# Altium schematic sheet top.SchDoc
size 420 x 297 mm; SheetNumber: 1; SheetTotal: 1
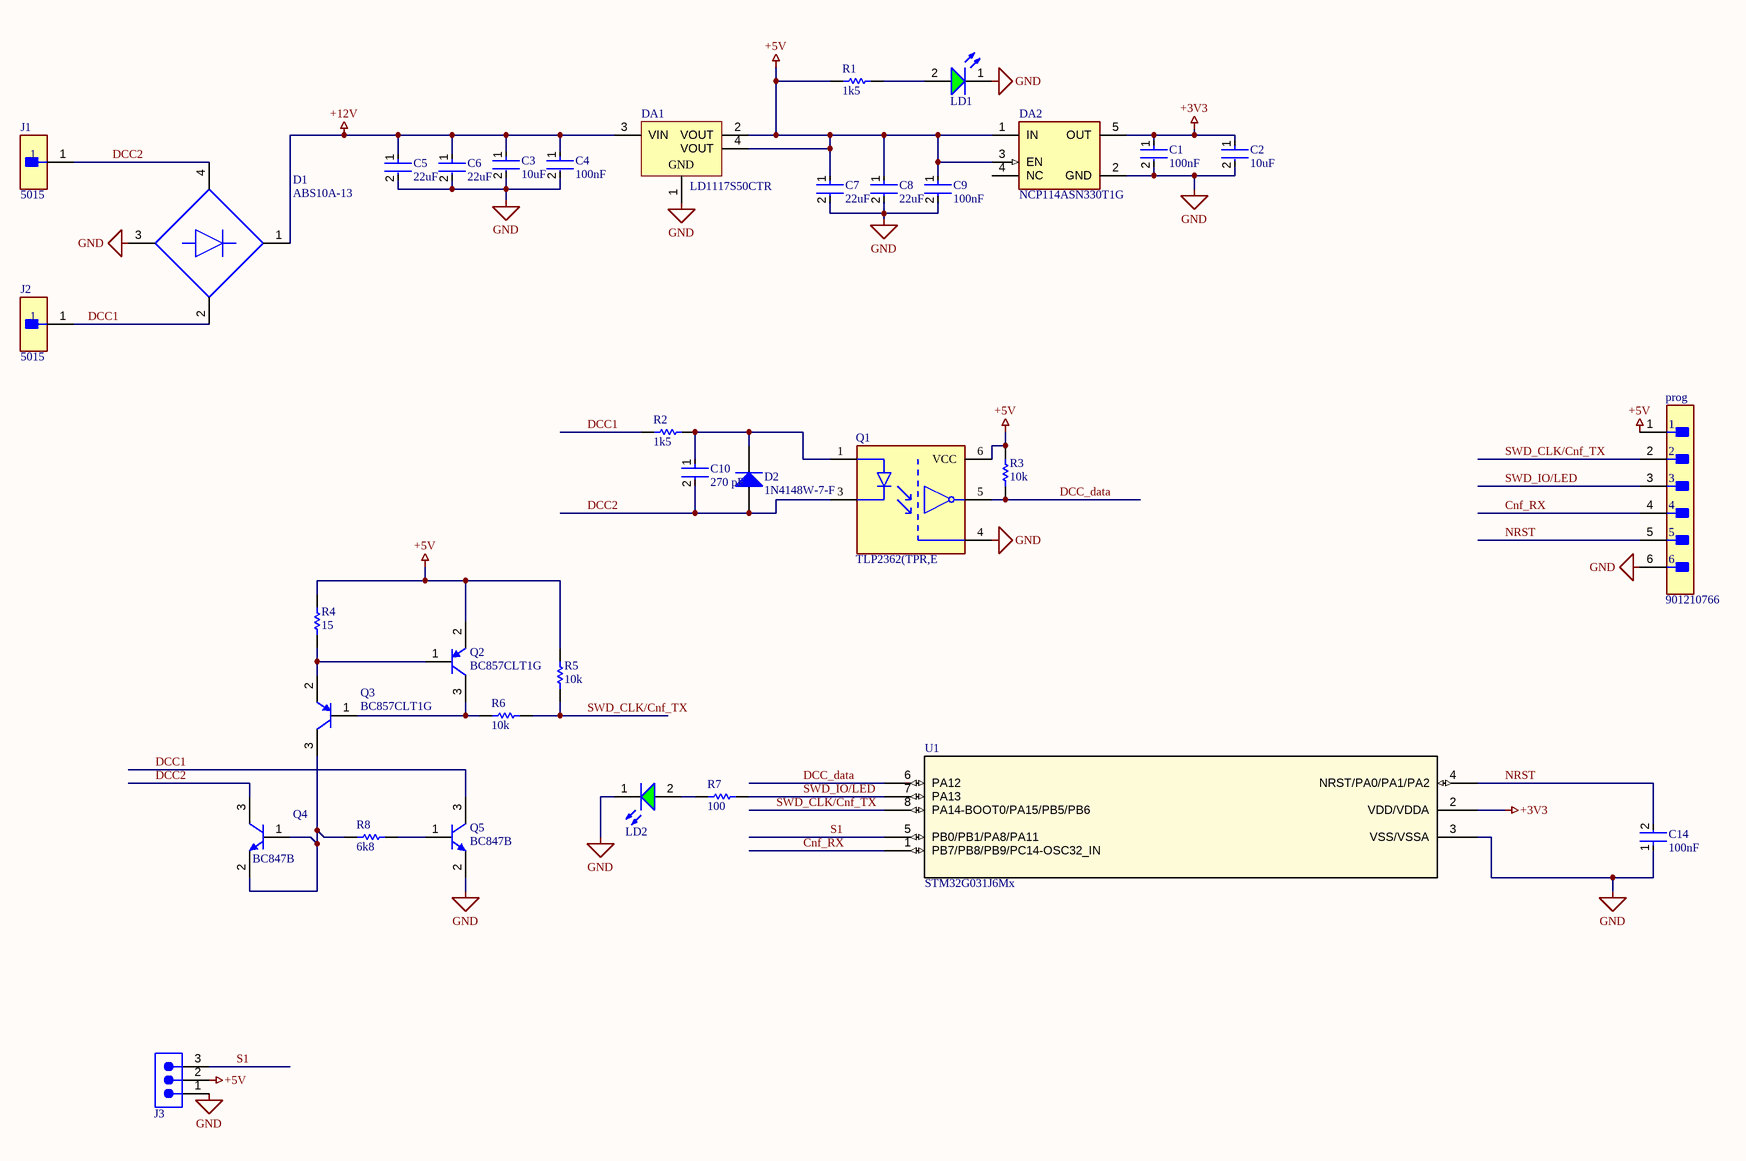
[diagram p0: top.SchDoc]

## Parts
C1  Capacitance: 100nF  [FP-CGA3E-0_3-0_1-MFG]  (hidden comment: CGA3E2X7R1H104K080AA)
C2  Capacitance: 10uF  [FP-GRM188-0_1-e0_2_0_55-MFG]  (hidden comment: GRM188R60J106ME47D)
C3  Capacitance: 10uF  [FP-GRM188-0_1-e0_2_0_55-MFG]  (hidden comment: GRM188R60J106ME47D)
C4  Capacitance: 100nF  [FP-CGA3E-0_3-0_1-MFG]  (hidden comment: CGA3E2X7R1H104K080AA)
C5  Capacitance: 22uF  [FP-GRM188-0_2-MFG]  (hidden comment: GRM188R61A226ME15D)
C6  Capacitance: 22uF  [FP-GRM188-0_2-MFG]  (hidden comment: GRM188R61A226ME15D)
C7  Capacitance: 22uF  [FP-GRM188-0_2-MFG]  (hidden comment: GRM188R61A226ME15D)
C8  Capacitance: 22uF  [FP-GRM188-0_2-MFG]  (hidden comment: GRM188R61A226ME15D)
C9  Capacitance: 100nF  [FP-CGA3E-0_3-0_1-MFG]  (hidden comment: CGA3E2X7R1H104K080AA)
C10  value 270 pF  [FP-C0603C-CF-IPC_C]  (hidden comment: C0603C271J5GACTU)
C14  Capacitance: 100nF  [FP-CGA3E-0_3-0_1-MFG]  (hidden comment: CGA3E2X7R1H104K080AA)
D1  ABS10A-13  [FP-SOPA-4-MFG]
D2  1N4148W-7-F  [DIOD-SOD123-2_V]
DA1  LD1117S50CTR  [SOT-223_N]
DA2  NCP114ASN330T1G  [FP-483-MFG]
J1  5015  [FP-5015-MFG]
J2  5015  [FP-5015-MFG]
J3  61300311021  [61300311021]  (value not drawn)
LD1  150060VS75000  [WL-SMCW_0603_150060xx75000]  (value not drawn)
LD2  150060VS75000  [WL-SMCW_0603_150060xx75000]  (value not drawn)
prog  901210766  [FP-901210766-MFG]
Q1  TLP2362(TPR,E  [FP-11-4L1S-MFG]
Q2  BC857CLT1G  [ONSC-SOT-23-3-318-08_V]
Q3  BC857CLT1G  [ONSC-SOT-23-3-318-08_V]
Q4  BC847B  [INF-SOT23_M]
Q5  BC847B  [INF-SOT23_M]
R1  value 1k5  [RESC1608X55X25ML10T15]  (hidden comment: RC0603FR-071K5L)
R2  value 1k5  [RESC1608X55X25ML10T15]  (hidden comment: RC0603FR-071K5L)
R3  value 10k  [RESC1609X55X30NL15T15]  (hidden comment: ERJ3EKF1002V)
R4  value 15  [RESC1608X55X30NL15T15]  (hidden comment: ERJ-3EKF1502V)
R5  value 10k  [RESC1609X55X30NL15T15]  (hidden comment: ERJ3EKF1002V)
R6  value 10k  [RESC1609X55X30NL15T15]  (hidden comment: ERJ3EKF1002V)
R7  value 100  [RESC1608X55X30NL15T15]  (hidden comment: ERJ-3EKF1003V)
R8  value 6k8  [RESC1608X55X25NL10T15]  (hidden comment: RC0603FR-076K8L)
U1  STM32G031J6Mx  [SO-8]

## Nets
+3V3: C1.1 C2.1 DA2.5(OUT) U1.2(VDD/VDDA)
+5V: C7.1 C8.1 C9.1 DA1.2(VOUT) DA1.4(VOUT) DA2.1(IN) DA2.3(EN) J3.2 prog.1 Q1.6(VCC) Q2.2(E) R1.1 R3.1 R4.2 R5.1
+12V: C3.1 C4.1 C5.1 C6.1 D1.1(+) DA1.3(VIN)
GND: C1.2 C2.2 C3.2 C4.2 C5.2 C6.2 C7.2 C8.2 C9.2 C14.1 D1.3(-) DA1.1(GND) DA2.2(GND) J3.1 LD1.1(K) LD2.1(K) prog.6 Q1.4(GND) Q5.2(E) U1.3(VSS/VSSA)
Cnf_RX: prog.4 U1.1(PB7/PB8/PB9/PC14-OSC32_IN)
DCC1: D1.2(1_~) J2.1 Q5.3(C) R2.1
DCC2: C10.2 D1.4(2_~) D2.1(A) J1.1 Q1.3(C) Q4.3(C)
DCC_data: Q1.5(Vo(output)) R3.2 U1.6(PA12)
NRST: C14.2 prog.5 U1.4(NRST/PA0/PA1/PA2)
S1: J3.3 U1.5(PB0/PB1/PA8/PA11)
SWD_CLK/Cnf_TX: prog.2 R5.2 R6.1 U1.8(PA14-BOOT0/PA15/PB5/PB6)
SWD_IO/LED: prog.3 R7.1 U1.7(PA13)
NetC10_1: C10.1 D2.2(K) Q1.1(A) R2.2
NetLD1_2: LD1.2(A) R1.2
NetLD2_2: LD2.2(A) R7.2
NetQ2_1: Q2.1(B) Q3.2(E) R4.1
NetQ2_3: Q2.3(C) Q3.1(B) R6.2
NetQ3_3: Q3.3(C) Q4.1(B) Q4.2(E) R8.1
NetQ5_1: Q5.1(B) R8.2

Not connected (* = marked no-connect by the designer): DA2 4(NC)

## Notes on the sheet
- THIS DOCUMENT AND THE DATA DISCLOSED HEREIN OR
- HEREWITH IS THE PROPERTY OF ALTIUM LIMITED AND MAY
- DWG NO:
- REVISION
- REV:
- DESCRIPTION
- DATE
- APPROVED
- BE FREELY DISTRIBUTED IN WHOLE. NO RIGHTS ARE
- RESERVED OR EXPRESS OR IMPLIED WARANTEE GIVEN.
- ENG:
- APPROVALS
- PROJECT
- DSN:
- CHK:
- REFERENCE DOCUMENTS
- PROJECT REVISION:
- TITLE
- DOCUMENT REVISION:
- DESIGN ITEM:
- BOM:
- FAB DWG:
- PCB DWG:
- ASSY DWG:
- SCALE:
- A3
- SIZE
- CAGE CODE
- FILE NAME
- DWG NO.
- SHEET
- OF
- REV

## Library data of the parts
C1 C4 C9 C14 = CMP-2000-07546-2: Cap Ceramic 100nF 50V X7R 10% Pad SMD 0603 +125°C Automotive T/R; Weight: 7.1E-05oz; Composition: Ceramic; Max Operating Temperature: 125°C; Termination: SMD/SMT; Dielectric: X7R; Length: 1.6mm; Package Quantity: 1; REACH SVHC: No SVHC; Lead Free: Lead Free; Case Code (Metric): 1608; Min Operating Temperature: -55°C; Packaging: Tape and Reel; Tolerance: 10%; Voltage Rating: 50V; Case Code (Imperial): 0603; Case/Package: 0603; Voltage Rating (DC): 50V; Depth: 0.8mm; Radiation Hardening: No; Ratings: AEC-Q200; Mount: Surface Mount; Voltage: 50V; Thickness: 0.035inch; Width: 0.8mm; Height: 0.8mm
C2 C3 = CMP-2006-02792-2: Chip Multilayer Ceramic Capacitors for General Purpose, 0603, 10uF, X5R, 15%, 20%, 6.3V; Packaging: Tape and Reel; Voltage Rating (DC): 6.3V; Width: 0.031inch; Termination: SMD/SMT; Dielectric: X5R; Package Quantity: 4000; Voltage Rating: 6.3V; Case/Package: 0603; Min Operating Temperature: -55°C; Voltage: 6.3V; Length: 1.6mm; Thickness: 0.035inch; Lead Free: Lead Free; Depth: 0.8mm; Case Code (Imperial): 0603; Max Operating Temperature: 85°C; Material: Ceramic; Height: 0.8mm; Tolerance: 20%; Mount: Surface Mount; REACH SVHC: No SVHC; Radiation Hardening: No; Case Code (Metric): 1608
C5-C8 = CMP-2000-06337-3: Chip Multilayer Ceramic Capacitors for General Purpose, 0603, 22uF, X5R, 15%, 20%, 10V; Tolerance: 20%; Weight: 0.000222oz; Material: Ceramic; Depth: 0.8mm; Length: 1.6mm; Termination: SMD/SMT; Packaging: Tape and Reel; Width: 0.8mm; Voltage Rating: 10V; Case Code (Imperial): 0603; Mount: Surface Mount; Voltage Rating (DC): 10V; Case/Package: 0603; Thickness: 0.039inch; REACH SVHC: No SVHC; Dielectric: X5R; Height: 0.8mm; Package Quantity: 4000; Case Code (Metric): 1608; Min Operating Temperature: -55°C; Lead Free: Lead Free; Max Operating Temperature: 85°C
C10 = CMP-2006-03310-2: CAP CER 270PF 50V C0G/NP0 0603; Manufacturer: KEMET; Automotive Grade: Grade 1; Temperature Characteristic: C0G; Description: C0603 270 pF C0G 30ppm/°C 5.00% 50 V; Temperature Coefficient: 30ppm/°C; Material: Ceramic; Tolerance: 0.05; Capacitance: 270 pF; Mouser Description: Multilayer Ceramic Capacitors MLCC - SMD/SMT 50volts 270pF C0G 5%; ComponentLink2Description: Datasheet; ComponentLink2URL: https://api.kemet.com/component-edge/download/datasheet/C0603C100J5GACAUTO.pdf; Temperature Range Low: -55°C; Digikey Description: CAP CER 270PF 50V C0G/NP0 0603; Category: Cap; Manufacturer Part Number: C0603C271J5GACTU; Voltage Rating: 50 V; Device Class L1: Passive Components; Temperature: -55°C to +125°C; Octopart: https://octopart.com/c0603c271j5gactu-kemet-136709; Package: C0603C-CF; Automotive: Yes; Temperature Range High: +125°C; Lead Free: Yes; Device Class L2: Capacitors; RoHS: TRUE; Height: 0.87mm; Device Class L3: Ceramic Capacitors
D1 = CMP-12791-000054-1: BRIDGE RECT 1PHASE 1KV 1A 4SOPA; Min Operating Temperature: -55°C; Max Operating Temperature: 150°C; Case/Package: SMD/SMT; Average Rectified Current: 1A; Mount: Surface Mount; Packaging: Cut Tape
D2 = CMP-2000-04932-2: Fast Switching Diode, 100 V, 0.15 A, -65 to 150 degC, 2-Pin?SOD123, RoHS, Tape and Reel; Recovery Time: 4ns; Brand: DiodesIncorporated; Unit Weight: 0.000353oz; Max Surge Current: 2A; Peak Reverse Voltage: 100V; Ir - Reverse Current: 1uA; Vf - Forward Voltage: 1.25V; Configuration: Single; If - Forward Current: 0.15A; Product Category: Diodes-GeneralPurpose,Power,Switching; Operating Temperature Range: -65Cto+150C; Packaging: Reel; Manufacturer URL: http://www.diodes.com/; Maximum Operating Temperature: +150C; Height: 1.25mm; Minimum Operating Temperature: -65C; Product: SwitchingDiodes; Package URL: http://www.diodes.com/datasheets/ds18004.pdf; Type: SwitchingDiode; Package Reference: SOD123-2; Width: 1.7mm; Datasheet URL: http://www.farnell.com/datasheets/1915529.pdf; Datasheet Version: Rev. 24-2, 10/2013; Series: 1N4148; Factory Pack Quantity: 3000; Length: 2.85mm; RoHS: True; Manufacturer: DiodesIncorporated; Mounting Style: SMD/SMT; Package / Case: SOD-123
DA1 = CMP-0244-00311-1: Fixed Low Drop Positive Voltage Regulator, 5V, 4-Pin SOT-223, Tape and Reel; PackageReference: SOT-223; PackageVersion: 2010; ComponentLink2URL: http://www.st.com/internet/com/TECHNICAL_RESOURCES/TECHNICAL_LITERATURE/DATASHEET/CD00000544.pdf; ComponentLink1URL: http://www.st.com; ComponentLink2Description: Datasheet; DatasheetVersion: 1/11/2011; ComponentLink1Description: Manufacturer URL; PackageDescription: 4-Pin SOT-223 Package, 6.5 x 3.5 mm Body, 2.3 mm Pitch, 7 mm Lead Span
DA2 = CMP-07128-000001-1: IC REG LINEAR 3.3V 300MA 5TSOP; Manufacturer: ON Semiconductor; Dropout Voltage: 150mV; Number Of Outputs: 1; Output Type: Fixed; Standoff Height: 0.01mm; Nominal Supply Current: 50uA; Accuracy Percentage: 1%; Max Junction Temp: +150°C; Min Supply Voltage: 1.7V; Max Supply Voltage: 5.5V; Output Voltage: 3.3V; Device Class L2: Power Management ICs; Digikey Description: IC REG LINEAR 3.3V 300MA 5TSOP; Footprint Url: https://www.onsemi.com/pub/Collateral/483.PDF; Temperature: to +150°C; RoHS: TRUE; Octopart: https://octopart.com/ncp114asn330t1g-on+semiconductor-74628742; Package: 483; Height: 1.1mm; Device Class L1: Integrated Circuits (ICs); Device Class L3: Voltage Regulators - Linear; ComponentLink2URL: https://www.onsemi.com/pub/Collateral/NCP114-D.PDF; Output Current: 300mA; Automotive: No; ComponentLink2Description: Datasheet; Manufacturer Part Number: NCP114ASN330T1G; Category: IC; Lead Free: Yes; Temperature Range High: +150°C
J1 J2 = CMP-2000-05183-2: PC TEST POINT MINIATURE; Manufacturer: keystone; Number Of Contacts: 1; Conn Orientation: Straight; Category: Conn; Manufacturer Part Number: 5015; Digikey Description: PC TEST POINT MINIATURE; Automotive: No; Lead Free: Yes; Octopart: https://octopart.com/5015-keystone-3822; ComponentLink2URL: http://www.keyelco.com/product-pdf.cfm?p=1353; Package: 5015; RoHS: TRUE; Device Class L3: unset; Device Class L2: unset; Contact Material: Silver; Device Class L1: Connectors; Height: 1.65mm; ComponentLink2Description: Datasheet
J3 = CMP-1502-01061-3: NexarPartId: 32855520; Contact Resistance: 20mΩ; Number of Positions: 3; Current Rating: 3A; Gender: Male; Operating Supply Voltage: 250V; Connector Type: Male Pin; Pitch: 2.54mm; Number of Rows: 1; Lead Pitch: 2.54mm; REACH SVHC: Unknown; Packaging: Bulk; Mount: Through Hole; Number of Pins: 3; Color: Black; Contact Plating: Gold; Contact Material: Copper; Number of Contacts: 3; Contact Mating Length: 5.9944mm; Termination: Solder; RoHS: Compliant
LD1 LD2 = CMP-1426-00006-7: WURTH ELEKTRONIK - 150060VS75000 - LED, Green, SMD, 0603, 30 mA, 2 V, 570 nm; Reverse Voltage: 5V; Power Dissipation: 72mW; Dominant Wavelength: 570nm; Peak Wavelength: 572nm; Forward Current: 100mA; Forward Voltage: 2V; Lens Style: Clear, Rectangular; Test Current: 20mA; Max Junction Temperature (Tj): 95°C; Viewing Angle: 140°; Luminous Intensity: 40mcd; Height: 700µm; Width: 800µm; Length: 1.6mm; Mount: Surface Mount; Min Operating Temperature: -40°C; Max Reverse Voltage (DC): 5V; Case Code (Imperial): 0603; Wavelength: 570nm; Color: Green; REACH SVHC: Unknown; RoHS: Compliant; Max Operating Temperature: 85°C; Packaging: Tape and Reel; Case/Package: 0603; Number of Pins: 2; Case Code (Metric): 1608
prog = CMP-04776-000096-1: CONN HEADER R/A 6POS 2.54MM; Manufacturer: Molex; Current Rating: 3A; Conn Orientation: Right Angle; Number Of Contacts: 6; Description: Connector Header Through Hole, Right Angle 6 position 0.100" (2.54mm); Conn Gender: Male; Voltage Rating: 350V; Manufacturer Part Number: 901210766; ComponentLink2Description: Datasheet; ComponentLink2URL: https://www.molex.com/webdocs/datasheets/pdf/en-us/0901210766_PCB_HEADERS.pdf; Pitch: 2.54mm; Number Of Rows: 1; RoHS: TRUE; Category: Conn; Lead Free: Yes; Digikey Description: CONN HEADER R/A 6POS 2.54MM; Height: 3.6mm; Footprint Url: https://www.molex.com/pdm_docs/sd/901210766_sd.pdf; Device Class L1: Connectors; Temperature: -55°C to +125°C; Package: 0; Octopart: https://octopart.com/90121-0766-molex-655456; Device Class L3: unset; Temperature Range Low: -55°C; Contact Material: Gold,Nickel; Device Class L2: Headers and Wire Housings; Temperature Range High: +125°C; Automotive: No
Q1 = CMP-35887-000013-1: OPTOISO 3.75KV OPEN COLL SO6-5; Propagation Delay: 100ns; Output Current per Channel: 25mA; Input Type: DC; Forward Voltage: 1.55V; Number of Channels: 1; Min Operating Temperature: -40°C; Max Operating Temperature: 125°C; Package Quantity: 3000; Packaging: Tape and Reel; Mount: Surface Mount; Series: -
Q2 Q3 = CMP-1048-00802-1: General Purpose Transistor, PNP Silicon, 3-Pin SOT-23, Pb-Free, Tape and Reel; Manufacturer: On Semiconductor; IC Continuous (A): -0.1; fT Min (MHz): 100; Polarity: PNP; PackageReference: SOT-23-3-318-08; ComponentLink3Description: Package Specification; ComponentLink2Description: Datasheet; PackageDescription: 3-Pin Small Outline Transistor, Body 2.92 x 1.3 mm, Pitch 0.95 mm; PackageVersion: Rev. AP, 11/2009; ComponentLink1Description: Manufacturer URL; PartNumber: BC857CLT1G; ComponentLink2URL: http://www.onsemi.cn/pub_link/Collateral/BC856ALT1-D.PDF; ComponentLink1URL: http://www.onsemi.com/; ComponentLink3URL: http://www.onsemi.cn/pub_link/Collateral/318-08.PDF; RoHS: TRUE; Packing: Tape and Reel; Mounting Technology: Surface Mount; DatasheetVersion: Rev. 13
Q4 Q5 = CMP-1177-00042-1: NPN Silicon AF Transistor, 45 V VCEO, 100 mA IC, SOT23, Reel, Green; Manufacturer: Infineon; VEBO (max): 6Â V; ICBO (max): 15Â nA; VCBO (max): 50Â V; IBM (max): 200Â mA; Green: TRUE; Ptot (max): 330Â mW; fT (typ): 250Â MHz; IC (max): 100Â mA; VCEO (max): 45Â V; PackageDescription: 3-Pin Small Outline Transistor Package, 1.3 x 2.9 mm Body, 0.95 mm Pitch; ComponentLink3URL: http://www.infineon.com/dgdl/SOT23-Package_Overview.pdf?folderId=db3a30431936bc4b0119532290053c66&fileId=db3a30431936bc4b0119533468123c85; PackageVersion: Apr-08; Packing: Reel; ComponentLink3Description: Package Specification; ComponentLink2URL: http://www.infineon.com/dgdl/bc847series_bc848series_bc849series_bc850series.pdf?folderId=db3a304314dca389011541d30fa21656&fileId=db3a304314dca389011541d4630a1657; ComponentLink1URL: http://www.infineon.com/; ComponentLink2Description: Datasheet; Polarity: NPN; Mounting Technology: Surface Mount; PackageReference: SOT23; ICM (max): 200Â mA; ComponentLink1Description: Manufacturer URL; PartNumber: BC847B
R1 R2 = CMP-2100-03665-1: Chip Resistor, 1.5 KOhm, +/- 1%, 0.1 W, -55 to 155 degC, 0603 (1608 Metric), RoHS, Tape and Reel; Manufacturer: Yageo; Power Rating: 100mW; Voltage Rating: 50V; Temperature Coefficient: 100ppm/degreesC; Military Standard: Not; Datasheet URL: http://www.yageo.com/NewPortal/yageodocoutput?fileName=/pdf/R-Chip/PYu-RC_Group_51_RoHS_L_5.pdf; Package Description: 2-Pin Surface Mount Device, Body 1.6 x 0.8 mm; Composition: ThickFilm; Case Code (Metric): 1608; Case/Package: 0603; Number of Terminations: 2; Depth: 0.8mm; Height: 0.022inch; Manufacturer URL: http://www.yageo.com/; Lead Free: LeadFree; Min Operating Temperature: -55degC; Max Operating Temperature: 155degC; Datasheet Version: Rev. 5, 10/2016; RoHSCompliant: true; Max Power Dissipation: 100mW; Packaging: TapeandReel; Voltage Rating (DC): 50V; Length: 0.063inch; Tolerance: 1%; Width: 0.031inch; Number of Pins: 2; Termination: SMD/SMT; Package Reference: 0603; Package Quantity: 1; Case Code (Imperial): 0603; Resistance: 1.5KOhm; REACH SVHC: NoSVHC
R3 R5 R6 = CMP-1012-00623-3: Chip Resistor, 10 KOhm, +/- 1%, 0.1 W, -55 to 155 degC, 0603 (1608 Metric), RoHS, Tape and Reel; Manufacturer: Panasonic; Voltage Rating: 75V; Case\/Package: 0603; Power Rating: 100mW; Resistance: 10KOhm; Temperature Coefficient: 100ppm\/degreesC; Number of Pins: 2; Package Reference: 603; Depth: 0.8mm; Mount: SurfaceMount; Package Description: 2-Pin Surface Mount Device, Body 1.6 x 0.85 mm; Datasheet Version: 02/2017; Length: 1.6mm; Lead Free: LeadFree; Height: 0.45mm; Number of Terminations: 2; Max Power Dissipation: 100mW; Min Operating Temperature: -55degC; Datasheet URL: https://industrial.panasonic.com/cdbs/www-data/pdf/RDA0000/AOA0000C304.pdf; Termination: SMD/SMT; Case Code (Metric): 1608; Case Code (Imperial): 0603; Tolerance: 1%; Max Operating Temperature: 155degC; RoHSCompliant: true; Voltage Rating (DC): 75V; Radiation Hardening: No; Packaging: TapeandReel; Composition: ThickFilm; Mounting Technology: SurfaceMount; Manufacturer URL: http://www.panasonic.com/; Width: 0.031inch; REACH SVHC: NoSVHC; Contact Plating: Tin; Military Standard: Not; Package Quantity: 1
R4 = CMP-2000-00258-1: Manufacturer: Panasonic; Part Number: ERJ-3EKF1502V
R7 = CMP-2000-00182-1: Manufacturer: Panasonic; Part Number: ERJ-3EKF1003V
R8 = CMP-1659-00046-1: Chip Resistor, 6.8 KOhm, +/- 1%, 100 mW, -55 to 155 degC, 0603 (1608 Metric), RoHS, Tape and Reel; Shielding: Unshielded; Gender: Female; Current Rating: 2 A; Case\Package: Metal; Voltage Rating: 34 V; Colour: Black; ComponentLink2URL: http://www.yageo.com/documents/recent/PYu-RC_Group_51_RoHS_L_04.pdf; REACH SVHC: Unknown; Package Quantity: 1; Height: 13 mm; Contact Material: Copper; ComponentLink1Description: Manufacturer URL; Min Operating Temperature: -25 degC; RoHSCompliant: true; ComponentLink2Description: Datasheet; PackageReference: 0603; Length: 19.5 mm; Pins: 1; Contact Plating: Silver; PackageDescription: 2-Pin Surface Mount Device, Body 1.6 x 0.8 mm; Max Operating Temperature: 85 degC; Mount: Through Hole; DatasheetVersion: Rev. 4, 02/2016; Width: 10 mm; ComponentLink1URL: http://www.yageo.com/
U1 = STM32G031J6Mx: The STM32G031x4/x6/x8 mainstream microcontrollers are based on high-performance Arm® Cortex®-M0+ 32-bit RISC core operating at up to 64 MHz frequency. / 32 Kbytes of Flash program memory and 8 Kbytes of SRAM. With 28pin UFQFPN 4x4x0.55 package; Manufacturer_Part_Number: stm32g0_so8_t1; Vendor: STMicroelectronics; Copyright: Copyright (C) 2018 Accelerated Designs. All rights reserved; RefDes: RefDes; Type: DEV; Value: Value